# Altium schematic sheet WL-ATT.SchDoc
size 420 x 297 mm; Scale: 1:1; DocumentType: Схема электрическая принципиальная; FirstReferrence: UA3REO/R7KBI; DocumentNumber: 7; SheetNumber: 10; SheetTotal: 12
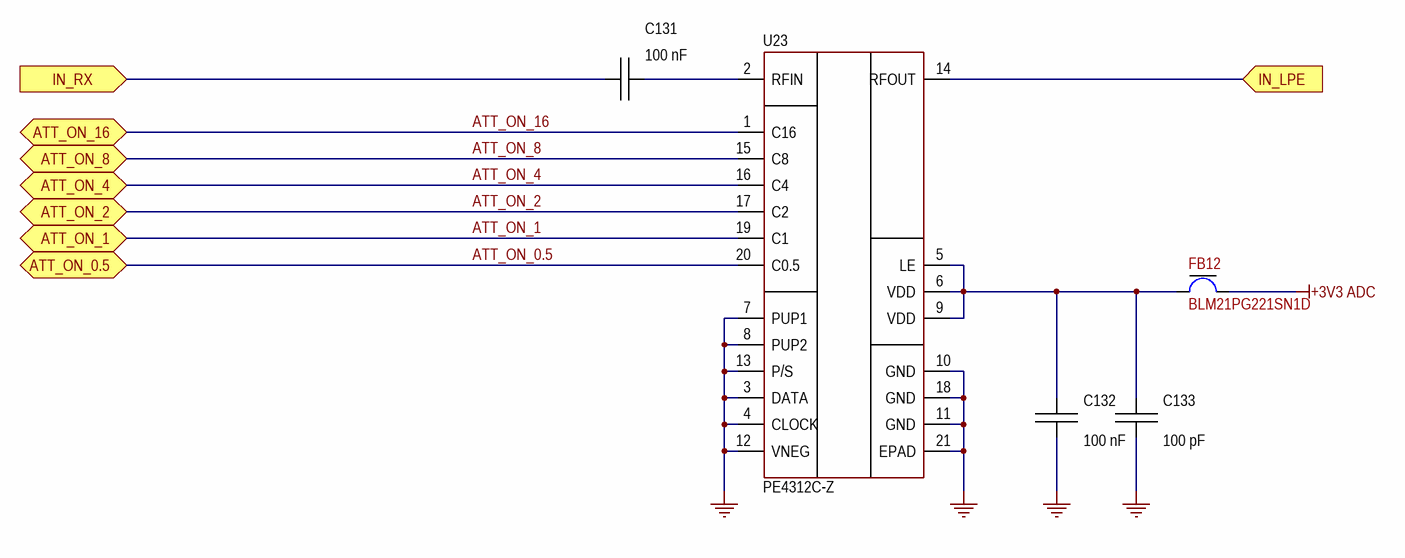
[diagram p0: WL-ATT.SchDoc]

## Parts
C131  100 nF  [C-0805-0.95]
C132  100 nF  [C-0805-0.95]
C133  100 pF  [C-0805-0.7]
FB12  BLM21PG221SN1D  [L-0805]
U23  PE4312C-Z  [QFN-20]

## Ports
ATT_ON_0.5 (bidir), ATT_ON_1 (bidir), ATT_ON_2 (bidir), ATT_ON_4 (bidir), ATT_ON_8 (bidir), ATT_ON_16 (bidir), IN_LPE (in), IN_RX (in)

## Nets
+3V3 ADC: FB12.2
GND: C132.1 C133.1 U23.3(DATA) U23.4(CLOCK) U23.7(PUP1) U23.8(PUP2) U23.10(GND) U23.11(GND) U23.12(VNEG) U23.13(P/S) U23.18(GND) U23.21(EPAD)
ATT_ON_0.5: U23.20(C0.5) ; port ATT_ON_0.5
ATT_ON_1: U23.19(C1) ; port ATT_ON_1
ATT_ON_2: U23.17(C2) ; port ATT_ON_2
ATT_ON_4: U23.16(C4) ; port ATT_ON_4
ATT_ON_8: U23.15(C8) ; port ATT_ON_8
ATT_ON_16: U23.1(C16) ; port ATT_ON_16
IN_LPE: U23.14(RFOUT) ; port IN_LPE
IN_RX: C131.1 ; port IN_RX
NetC131_2: C131.2 U23.2(RFIN)
NetC132_2: C132.2 C133.2 FB12.1 U23.5(LE) U23.6(VDD) U23.9(VDD)

## Notes on the sheet
- Подп. дата
- Инв. № дубл.
- Взам. инв. №
- Подп. и дата
- Инв. № подл.
- Изм.
- Лист
- № докум.
- Подп.
- Дата
- ALTIUM GOSTBOM2.0 KEV
- Файл:
- Копировал
- Формат А3

## Library data of the parts
C131 C132 = CC0805KRX7R9BB104: Manufacturer: Yageo; Value: 100; Type: Конденсатор; Dielectric: X7R; Tolerance: ±10%; Voltage: 50 V; CommentDOC: ( CC - 0805 - X7R - 50 V - 100 nF ±10% ); Part Number: CC0805KRX7R9BB104; Units: nF; Case: 0805; Operating Temperature: -55 ... 125 °C; Series: CC; Value+Units: 100 nF; ValueSCH: 100 nF; ( Series - Case - Dielectric -  Voltage - Value+Units Tolerance: ( CC - 0805 - X7R - 50 V - 100 nF ±10% )
C133 = CC0805JRNPO9BN101: Manufacturer: Yageo; Value: 100; Type: Конденсатор; Dielectric: NPO; Tolerance: ±5%; Voltage: 50 V; CommentDOC: ( CC - 0805 - NPO - 50 V - 100 pF ±5% ); Part Number: CC0805JRNPO9BN101; Units: pF; Case: 0805; Operating Temperature: -55 ... 125 °C; Series: CC; Value+Units: 100 pF; ValueSCH: 100 pF; ( Series - Case - Dielectric -  Voltage - Value+Units Tolerance: ( CC - 0805 - NPO - 50 V - 100 pF ±5% )
FB12 = BLM21PG221SN1D: Manufacturer: Murata Electronics; Type: Ферритовая бусина; Part Number: BLM21PG221SN1D; Series: EMIFIL; Case: 0805; ValueSCH: BLM21PG221SN1D; Operating Temperature: −55°C ... 125°C
U23 = PE4312C-Z: RF ATTENUATOR 31.5DB 50 OHM; Manufacturer: pSemi; Voltage  Supply: +2,3 V...±5.5 V; Part Number: PE4312C-Z; Function: RF ATTENUATOR 31.5DB 50 OHM; Case: QFN-20; Operating Temperature: -55 ... 105 °C; Type: Микросхема